# EAGLE design EIB36-JAE (EAGLE 9.1.1)
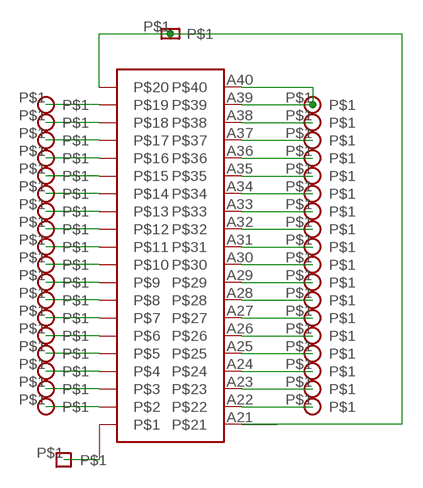
[diagram p0: schematic, sheet 1]

## Parts
U$1  WR-40SB-VFH30  [WR-40SB-VFH30]
U$2  EIB-GND-HOLE-PAD-SMALL  [EIB-GND-HOLE-PAD-SMALL]
U$3  EIB-GND-HOLE-PAD  [EIB-GND-HOLE-PAD]
U$4  EIB-TETRODE-HOLE-PAD  [EIB-TETRODE-HOLE-PAD]
U$5  EIB-TETRODE-HOLE-PAD  [EIB-TETRODE-HOLE-PAD]
U$6  EIB-TETRODE-HOLE-PAD  [EIB-TETRODE-HOLE-PAD]
U$7  EIB-TETRODE-HOLE-PAD  [EIB-TETRODE-HOLE-PAD]
U$8  EIB-TETRODE-HOLE-PAD  [EIB-TETRODE-HOLE-PAD]
U$9  EIB-TETRODE-HOLE-PAD  [EIB-TETRODE-HOLE-PAD]
U$10  EIB-TETRODE-HOLE-PAD  [EIB-TETRODE-HOLE-PAD]
U$11  EIB-TETRODE-HOLE-PAD  [EIB-TETRODE-HOLE-PAD]
U$12  EIB-TETRODE-HOLE-PAD  [EIB-TETRODE-HOLE-PAD]
U$13  EIB-TETRODE-HOLE-PAD  [EIB-TETRODE-HOLE-PAD]
U$14  EIB-TETRODE-HOLE-PAD  [EIB-TETRODE-HOLE-PAD]
U$15  EIB-TETRODE-HOLE-PAD  [EIB-TETRODE-HOLE-PAD]
U$16  EIB-TETRODE-HOLE-PAD  [EIB-TETRODE-HOLE-PAD]
U$17  EIB-TETRODE-HOLE-PAD  [EIB-TETRODE-HOLE-PAD]
U$18  EIB-TETRODE-HOLE-PAD  [EIB-TETRODE-HOLE-PAD]
U$19  EIB-TETRODE-HOLE-PAD  [EIB-TETRODE-HOLE-PAD]
U$20  EIB-TETRODE-HOLE-PAD  [EIB-TETRODE-HOLE-PAD]
U$21  EIB-TETRODE-HOLE-PAD  [EIB-TETRODE-HOLE-PAD]
U$22  EIB-TETRODE-HOLE-PAD  [EIB-TETRODE-HOLE-PAD]
U$23  EIB-TETRODE-HOLE-PAD  [EIB-TETRODE-HOLE-PAD]
U$24  EIB-TETRODE-HOLE-PAD  [EIB-TETRODE-HOLE-PAD]
U$25  EIB-TETRODE-HOLE-PAD  [EIB-TETRODE-HOLE-PAD]
U$26  EIB-TETRODE-HOLE-PAD  [EIB-TETRODE-HOLE-PAD]
U$27  EIB-TETRODE-HOLE-PAD  [EIB-TETRODE-HOLE-PAD]
U$28  EIB-TETRODE-HOLE-PAD  [EIB-TETRODE-HOLE-PAD]
U$29  EIB-TETRODE-HOLE-PAD  [EIB-TETRODE-HOLE-PAD]
U$30  EIB-TETRODE-HOLE-PAD  [EIB-TETRODE-HOLE-PAD]
U$31  EIB-TETRODE-HOLE-PAD  [EIB-TETRODE-HOLE-PAD]
U$32  EIB-TETRODE-HOLE-PAD  [EIB-TETRODE-HOLE-PAD]
U$33  EIB-TETRODE-HOLE-PAD  [EIB-TETRODE-HOLE-PAD]
U$34  EIB-TETRODE-HOLE-PAD  [EIB-TETRODE-HOLE-PAD]
U$35  EIB-TETRODE-HOLE-PAD  [EIB-TETRODE-HOLE-PAD]
U$36  EIB-TETRODE-HOLE-PAD  [EIB-TETRODE-HOLE-PAD]
U$37  EIB-TETRODE-HOLE-PAD  [EIB-TETRODE-HOLE-PAD]
U$38  EIB-TETRODE-HOLE-PAD  [EIB-TETRODE-HOLE-PAD]
U$39  EIB-TETRODE-HOLE-PAD  [EIB-TETRODE-HOLE-PAD]

## Nets
N$1: U$1.A20 U$1.A21 U$2.P$1
N$2: U$1.A1 U$3.P$1
N$5: U$1.A19 U$4.P$1
N$6: U$1.A18 U$5.P$1
N$7: U$1.A17 U$6.P$1
N$8: U$1.A16 U$7.P$1
N$9: U$1.A15 U$8.P$1
N$10: U$1.A14 U$9.P$1
N$11: U$1.A13 U$10.P$1
N$12: U$1.A12 U$11.P$1
N$13: U$1.A11 U$12.P$1
N$14: U$1.A10 U$13.P$1
N$15: U$1.A9 U$14.P$1
N$16: U$1.A8 U$15.P$1
N$17: U$1.A7 U$16.P$1
N$18: U$1.A6 U$17.P$1
N$19: U$1.A5 U$18.P$1
N$20: U$1.A4 U$19.P$1
N$21: U$1.A3 U$20.P$1
N$22: U$1.A2 U$21.P$1
N$23: U$1.A39 U$1.A40 U$22.P$1
N$24: U$1.A38 U$23.P$1
N$25: U$1.A37 U$24.P$1
N$26: U$1.A36 U$25.P$1
N$27: U$1.A35 U$26.P$1
N$28: U$1.A34 U$27.P$1
N$29: U$1.A33 U$28.P$1
N$30: U$1.A32 U$29.P$1
N$31: U$1.A31 U$30.P$1
N$32: U$1.A30 U$31.P$1
N$33: U$1.A29 U$32.P$1
N$34: U$1.A28 U$33.P$1
N$35: U$1.A27 U$34.P$1
N$36: U$1.A26 U$35.P$1
N$37: U$1.A25 U$36.P$1
N$38: U$1.A24 U$37.P$1
N$39: U$1.A23 U$38.P$1
N$40: U$1.A22 U$39.P$1

## Library data of the parts
U$1 = EIBLibrary:WR-40SB-VFH30
U$2 = EIBLibrary:EIB-GND-HOLE-PAD-SMALL
U$3 = EIBLibrary:EIB-GND-HOLE-PAD
U$4-U$39 = EIBLibrary:EIB-TETRODE-HOLE-PAD

## Board
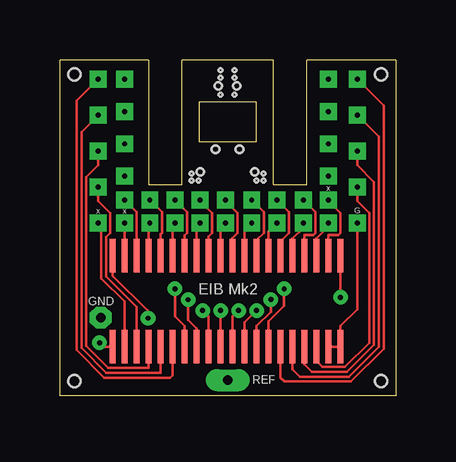
[diagram p1: board, top side]
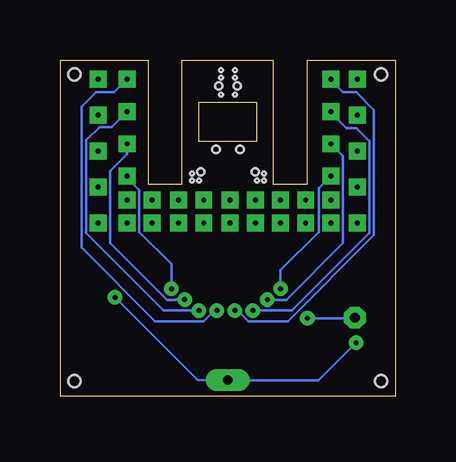
[diagram p2: board, bottom side, seen from below]

Size 14 x 14 mm. Coordinates in mm from the lower left corner, seen from the top.
Outline: 0,0 0,14 3.7,14 3.7,8.8 5.1,8.8 5.1,14 8.9,14 8.9,8.8 10.3,8.8 10.3,14 14,14 14,0 0,0
Outline: 5.8,12.25 5.8,10.6 8.2,10.6 8.2,12.25 5.8,12.25
Copper layers (1*16): Top 0.035mm / dielectric 1mm / Bottom 0.035mm
Design rules "default *": minimum track width 0.1mm, minimum drill 0.15mm, track to track 0.1mm, track to pad 0.1mm, pad to pad 0.1mm, via to via 0.1mm, smd to smd 0.1mm, copper to edge 6mil, drill to drill 0.1mm, minimum pad ring 10mil, minimum via ring 8mil, stop-mask expansion 4mil, vias tented up to drill 0mil, thermal gap 5mil
Holes 0.15 mm at 8.49,9.27 8.19,8.97 8.49,8.97 7.29,12.55 7.29,13.27 7.29,13.57 5.49,9.27 5.49,8.97 5.79,8.97 6.69,12.55 6.69,13.27 6.69,13.57
Holes 0.3 mm at 8.13,9.33 7.37,12.91 7.49,10.27 6.49,10.27 6.61,12.91 5.85,9.33
Holes 0.5 mm at 13.4,13.4 0.6,0.6 13.4,0.6 0.6,13.4

### Footprints (pad centres in the part's own frame; a part is rotated, then mirrored left to right if it is on the bottom)
WR-40SB-VFH30 = smd 0.25 x 1.4: A1 0,0; A2 0.5,0; A3 1,0; A4 1.5,0; A5 2,0; A6 2.5,0; A7 3,0; A8 3.5,0; A9 4,0; A10 4.5,0; A11 5,0; A12 5.5,0; A13 6,0; A14 6.5,0; A15 7,0; A16 7.5,0; A17 8,0; A18 8.5,0; A19 9,0; A20 9.5,0; A21 0,-3.8; A22 0.5,-3.8; A23 1,-3.8; A24 1.5,-3.8; A25 2,-3.8; A26 2.5,-3.8; A27 3,-3.8; A28 3.5,-3.8; A29 4,-3.8; A30 4.5,-3.8; A31 5,-3.8; A32 5.5,-3.8; A33 6,-3.8; A34 6.5,-3.8; A35 7,-3.8; A36 7.5,-3.8; A37 8,-3.8; A38 8.5,-3.8; A39 9,-3.8; A40 9.5,-3.8
EIB-GND-HOLE-PAD-SMALL = drill 0.4 pad 0.41 long: P$1 0,0
EIB-GND-HOLE-PAD = drill 0.4 pad 0.8 octagon: P$1 0,0
EIB-TETRODE-HOLE-PAD = drill 0.2 pad 0.38 square: P$1 0,0

### Placement (x,y rotation side)
U$1  2.2,5.84 0 top
U$2  7,0.64 0 top
U$3  1.7,3.25 0 top
U$4  11.2,8.15 90 top
U$5  11.2,7.2 180 top
U$6  10.15,8.15 180 top
U$7  10.15,7.2 180 top
U$8  9.05,8.15 180 top
U$9  9.05,7.2 180 top
U$10  8,8.15 90 top
U$11  8,7.2 90 top
U$12  6.9,8.15 90 top
U$13  6.9,7.2 90 top
U$14  5.85,8.15 90 top
U$15  5.85,7.2 90 top
U$16  4.8,8.15 180 top
U$17  4.8,7.2 180 top
U$18  3.75,8.15 180 top
U$19  3.75,7.2 180 top
U$20  2.7,8.15 180 top
U$21  2.7,7.2 180 top
U$22  12.4,7.2 90 top
U$23  12.4,8.7 90 top
U$24  12.4,10.2 90 top
U$25  12.4,11.7 90 top
U$26  12.4,13.2 90 top
U$27  11.2,9.15 270 top
U$28  11.2,10.5 270 top
U$29  11.2,11.85 270 top
U$30  11.2,13.2 270 top
U$31  2.7,13.2 90 top
U$32  2.7,11.85 90 top
U$33  2.7,10.5 90 top
U$34  2.7,9.15 180 top
U$35  1.6,13.2 180 top
U$36  1.6,11.7 180 top
U$37  1.6,10.2 180 top
U$38  1.6,8.7 180 top
U$39  1.6,7.2 180 top

### Tracks (layer width: path | path; a pad name or v marks a point on that pad's centre or on a via)
N$1  (via drill 0.2)
  Top 0.1: U$1.A20 v11.7,4.1 | U$1.A21 1.81,2.04 v1.65,2.2
  Bottom 0.1: v11.7,4.1 8.25,0.65 7.15,0.64 U$2.P$1 3.21,0.64 v1.65,2.2
N$2  (via drill 0.2)
  Top 0.1: U$1.A1 2.2,5 3.68,3.52 v3.68,3.23
  Bottom 0.1: v3.68,3.23 1.72,3.23 U$3.P$1
N$5
  Top 0.1: U$1.A19 11.2,6.7 11.62,6.7 11.7,6.78 11.7,7.62 11.2,8.12 U$4.P$1
N$6
  Top 0.1: U$1.A18 10.7,6.55 11.2,7.05 U$5.P$1
N$7
  Top 0.1: U$1.A17 10.2,6.7 10.57,6.7 10.65,6.78 10.65,7.65 U$6.P$1
N$8
  Top 0.1: U$1.A16 9.7,6.55 10.15,7 U$7.P$1
N$9
  Top 0.1: U$1.A15 9.2,6.43 9.55,6.78 9.55,7.65 U$8.P$1
N$10
  Top 0.1: U$1.A14 8.7,6.7 8.7,6.85 U$9.P$1
N$11
  Top 0.1: U$1.A13 8.2,6.48 8.5,6.78 8.5,7.65 U$10.P$1
N$12
  Top 0.1: U$1.A12 7.7,6.9 U$11.P$1
N$13
  Top 0.1: U$1.A11 7.2,6.58 7.4,6.78 7.4,7.62 6.9,8.12 U$12.P$1
N$14
  Top 0.1: U$1.A10 6.7,7 U$13.P$1
N$15
  Top 0.1: U$1.A9 6.2,6.63 6.35,6.78 6.35,7.62 5.85,8.12 U$14.P$1
N$16
  Top 0.1: U$1.A8 5.7,7.05 U$15.P$1
N$17
  Top 0.1: U$1.A7 5.2,6.65 | 5.2,6.65 5.2,6.68 | 5.2,6.65 5.2,6.68 | 5.2,6.68 5.3,6.78 5.3,7.65 U$16.P$1
N$18
  Top 0.1: U$1.A6 4.7,7.1 U$17.P$1
N$19
  Top 0.1: U$1.A5 4.2,6.73 4.25,6.78 4.25,7.65 U$18.P$1
N$20
  Top 0.1: U$1.A4 3.7,7.15 U$19.P$1
N$21
  Top 0.1: U$1.A3 3.2,6.78 3.2,7.65 U$20.P$1
N$22
  Top 0.1: U$1.A2 U$21.P$1
N$23
  Top 0.1: U$22.P$1 12.4,4.1 | U$1.A39 U$1.A40 11.7,2.9 12.4,3.6 12.4,4.1 | 12.4,4.1
N$24
  Top 0.1: U$23.P$1 12.4,8.12 12.9,7.62 12.9,2.21 11.89,1.19 11.01,1.19 11,1.2 10.95,1.2 10.7,1.45 U$1.A38
N$25
  Top 0.1: U$24.P$1 12.4,9.62 13.1,8.92 13.1,2.12 11.97,0.99 10.93,0.99 10.92,1 10.5,1 10.2,1.3 U$1.A37
N$26
  Top 0.1: U$1.A36 9.7,1.1 10.01,0.79 12.05,0.79 13.3,2.04 13.3,10.8 U$25.P$1
N$27
  Top 0.1: U$1.A35 9.2,0.75 9.36,0.59 12.14,0.59 13.5,1.95 13.5,12.1 U$26.P$1
N$28  (via drill 0.2)
  Top 0.1: U$1.A34 8.7,3.1 9.35,3.75 v9.35,4.45
  Bottom 0.1: v9.35,4.45 9.35,5.48 10.7,6.83 10.7,8.57 11.2,9.07 U$27.P$1
N$29  (via drill 0.2)
  Top 0.1: U$1.A33 8.2,2.9 8.8,3.5 v8.8,4.01
  Bottom 0.1: v8.8,4.01 9.15,4.01 9.16,4 9.54,4 11.9,6.36 11.9,9.37 11.2,10.07 U$28.P$1
N$30  (via drill 0.2)
  Top 0.1: U$1.A32 7.7,3.05 v8.2,3.55
  Bottom 0.1: v8.2,3.55 | U$29.P$1 11.85,11.2 11.98,11.2 12.35,11.2 12.9,10.65 12.9,10.62 12.9,6.78 9.67,3.55 v8.2,3.55
N$31  (via drill 0.2)
  Top 0.1: U$1.A31 7.2,3.3 v7.45,3.55
  Bottom 0.1: 13.1,10.7 | 13.1,10.7 13.1,12.05 12.5,12.65 11.75,12.65 U$30.P$1 | 13.1,10.7 | 13.1,10.7 13.1,6.17 10.03,3.1 8.01,3.1 7.56,3.55 v7.45,3.55
N$32  (via drill 0.2)
  Top 0.1: U$1.A30 v6.7,3.55
  Bottom 0.1: v6.7,3.55 6.59,3.55 6.14,3.1 4.5,3.1 0.9,6.7 0.9,11.92 1.63,12.65 2.2,12.65 2.7,13.15 U$31.P$1
N$33  (via drill 0.2)
  Top 0.1: U$1.A29 6.2,3.3 v5.95,3.55
  Bottom 0.1: 1.1,6.78 1.11,6.76 | 1.11,6.76 4.33,3.55 v5.95,3.55 | U$32.P$1 2.7,11.8 2.05,11.15 1.63,11.15 1.1,10.62 1.1,6.78 | 1.1,6.78 1.11,6.76
N$34  (via drill 0.2)
  Top 0.1: v5.35,4 5.35,3.15 5.7,2.8 U$1.A28
  Bottom 0.1: v5.35,4 4.94,4 4.56,4 2.2,6.36 2.2,10 U$33.P$1
N$35  (via drill 0.2)
  Top 0.1: v4.8,4.45 4.8,3.3 5.2,2.9 U$1.A27
  Bottom 0.1: v4.8,4.45 4.8,5.23 3.2,6.83 3.2,8.65 U$34.P$1
N$36
  Top 0.1: U$1.A26 4.7,0.85 4.6,0.75 1.85,0.75 0.7,1.9 0.7,12.3 U$35.P$1
N$37
  Top 0.1: U$1.A25 4.2,0.95 1.93,0.95 0.9,1.98 0.9,11 U$36.P$1
N$38
  Top 0.1: U$37.P$1 1.6,9.62 1.1,9.12 1.1,2.07 2.01,1.15 3.7,1.15 U$1.A24
N$39
  Top 0.1: U$38.P$1 1.6,8.12 2.1,7.62 2.1,6.78 1.93,6.61 1.93,4.97 3.2,3.7 U$1.A23
N$40
  Top 0.1: U$1.A22 2.7,3.92 1.73,4.89 1.73,7.08 U$39.P$1

### Text on the board
tPlace: x | x | x | G | GND | EIB Mk2 | REF